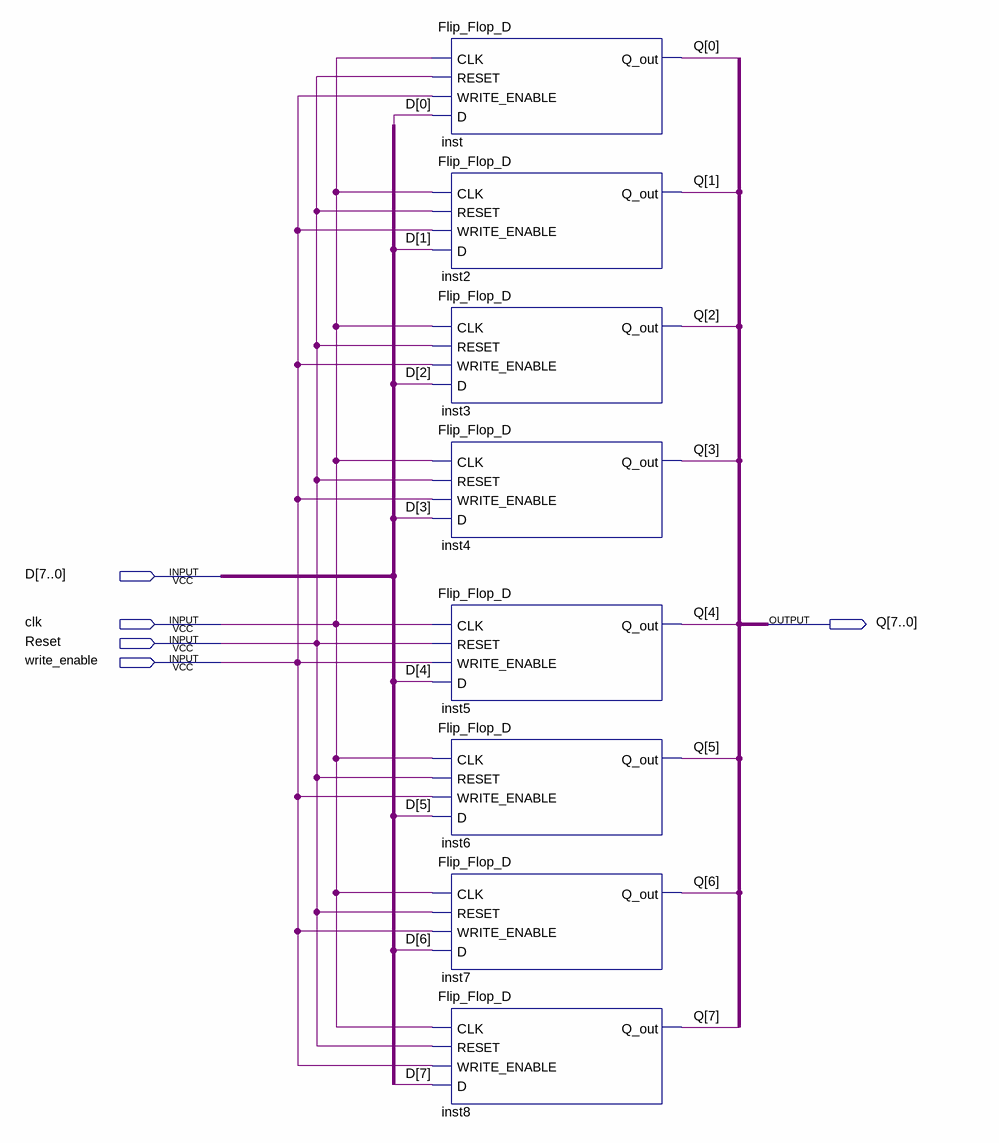
[diagram p0: schematic sheet]
// Quartus schematic Registrador_8bits.bdf as structural Verilog: 8 symbols, 5 pins
module Registrador_8bits (
  input  [7:0] D,
  input  clk,
  input  Reset,
  input  write_enable,
  output [7:0] Q
);

  Flip_Flop_D inst (.CLK(clk), .RESET(Reset), .WRITE_ENABLE(write_enable), .D(D[0]), .Q_out(Q[0]));
  Flip_Flop_D inst2 (.CLK(clk), .RESET(Reset), .WRITE_ENABLE(write_enable), .D(D[1]), .Q_out(Q[1]));
  Flip_Flop_D inst3 (.CLK(clk), .RESET(Reset), .WRITE_ENABLE(write_enable), .D(D[2]), .Q_out(Q[2]));
  Flip_Flop_D inst4 (.CLK(clk), .RESET(Reset), .WRITE_ENABLE(write_enable), .D(D[3]), .Q_out(Q[3]));
  Flip_Flop_D inst5 (.CLK(clk), .RESET(Reset), .WRITE_ENABLE(write_enable), .D(D[4]), .Q_out(Q[4]));
  Flip_Flop_D inst6 (.CLK(clk), .RESET(Reset), .WRITE_ENABLE(write_enable), .D(D[5]), .Q_out(Q[5]));
  Flip_Flop_D inst7 (.CLK(clk), .RESET(Reset), .WRITE_ENABLE(write_enable), .D(D[6]), .Q_out(Q[6]));
  Flip_Flop_D inst8 (.CLK(clk), .RESET(Reset), .WRITE_ENABLE(write_enable), .D(D[7]), .Q_out(Q[7]));
endmodule
